# EAGLE design slouchpad_v1_rightpad (EAGLE 8.0.1)

## Sheet 1 of 2
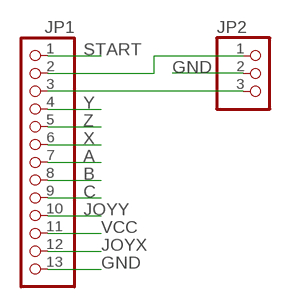
[diagram p0: schematic, sheet 1]

### Parts
JP1  PINHD-1X13  [1X13]
JP2  PINHD-1X3  [1X03]

### Nets
A: JP1.7 ; also sheet 2
B: JP1.8 ; also sheet 2
C: JP1.9 ; also sheet 2
GND: JP1.13 JP2.2 ; also sheet 2
JOYX: JP1.12 ; also sheet 2
JOYY: JP1.10 ; also sheet 2
N$2: JP1.2 JP2.1
N$3: JP1.3 JP2.3
START: JP1.1 ; also sheet 2
VCC: JP1.11 ; also sheet 2
X: JP1.6 ; also sheet 2
Y: JP1.4 ; also sheet 2
Z: JP1.5 ; also sheet 2

## Sheet 2 of 2
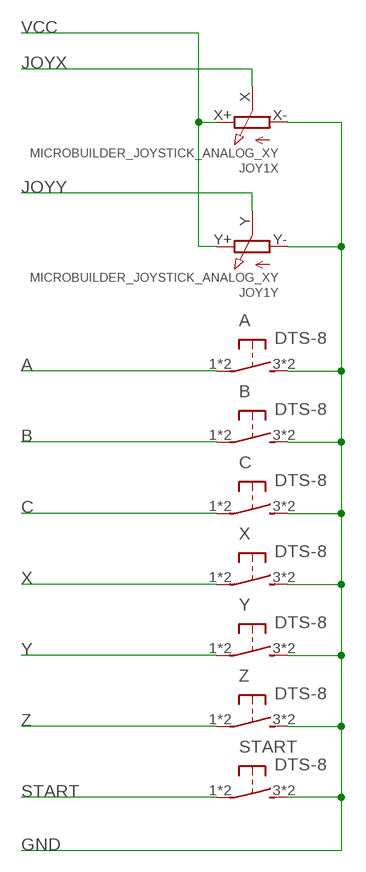
[diagram p1: schematic, sheet 2]

### Parts
A  DTS-8  [DTS-8]
B  DTS-8  [DTS-8]
C  DTS-8  [DTS-8]
JOY1  MICROBUILDER_JOYSTICK_ANALOG_XY  [MICROBUILDER_JOYSTICK_ANALOG_MINITHM]
START  DTS-8  [DTS-8]
X  DTS-8  [DTS-8]
Y  DTS-8  [DTS-8]
Z  DTS-8  [DTS-8]

### Nets
A: A.1 A.2 ; also sheet 1
B: B.1 B.2 ; also sheet 1
C: C.1 C.2 ; also sheet 1
GND: A.3 A.4 B.3 B.4 C.3 C.4 JOY1.X-(X:A) JOY1.Y-(Y:A) START.3 START.4 X.3 X.4 Y.3 Y.4 Z.3 Z.4 ; also sheet 1
JOYX: JOY1.X(X:S) ; also sheet 1
JOYY: JOY1.Y(Y:S) ; also sheet 1
START: START.1 START.2 ; also sheet 1
VCC: JOY1.X+(X:E) JOY1.Y+(Y:E) ; also sheet 1
X: X.1 X.2 ; also sheet 1
Y: Y.1 Y.2 ; also sheet 1
Z: Z.1 Z.2 ; also sheet 1

## Library data of the parts
A B C START X Y Z = switch-tact:DTS-8
JOY1 = adafruit-minianalogthumb:MICROBUILDER_JOYSTICK_ANALOG_XY
JP1 = pinhead:PINHD-1X13: PIN HEADER
JP2 = pinhead:PINHD-1X3: PIN HEADER

## Board
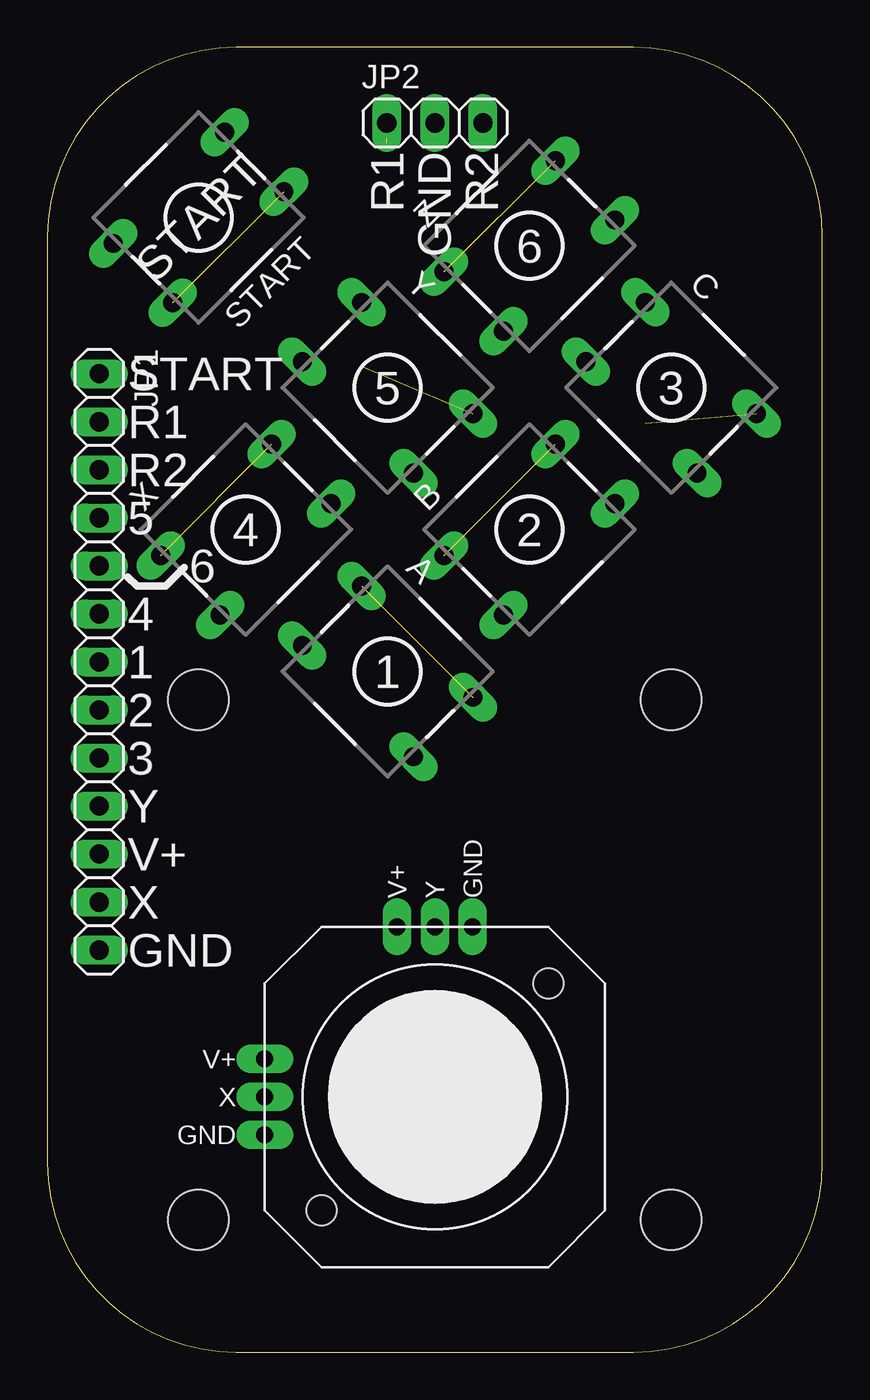
[diagram p2: board, top side]
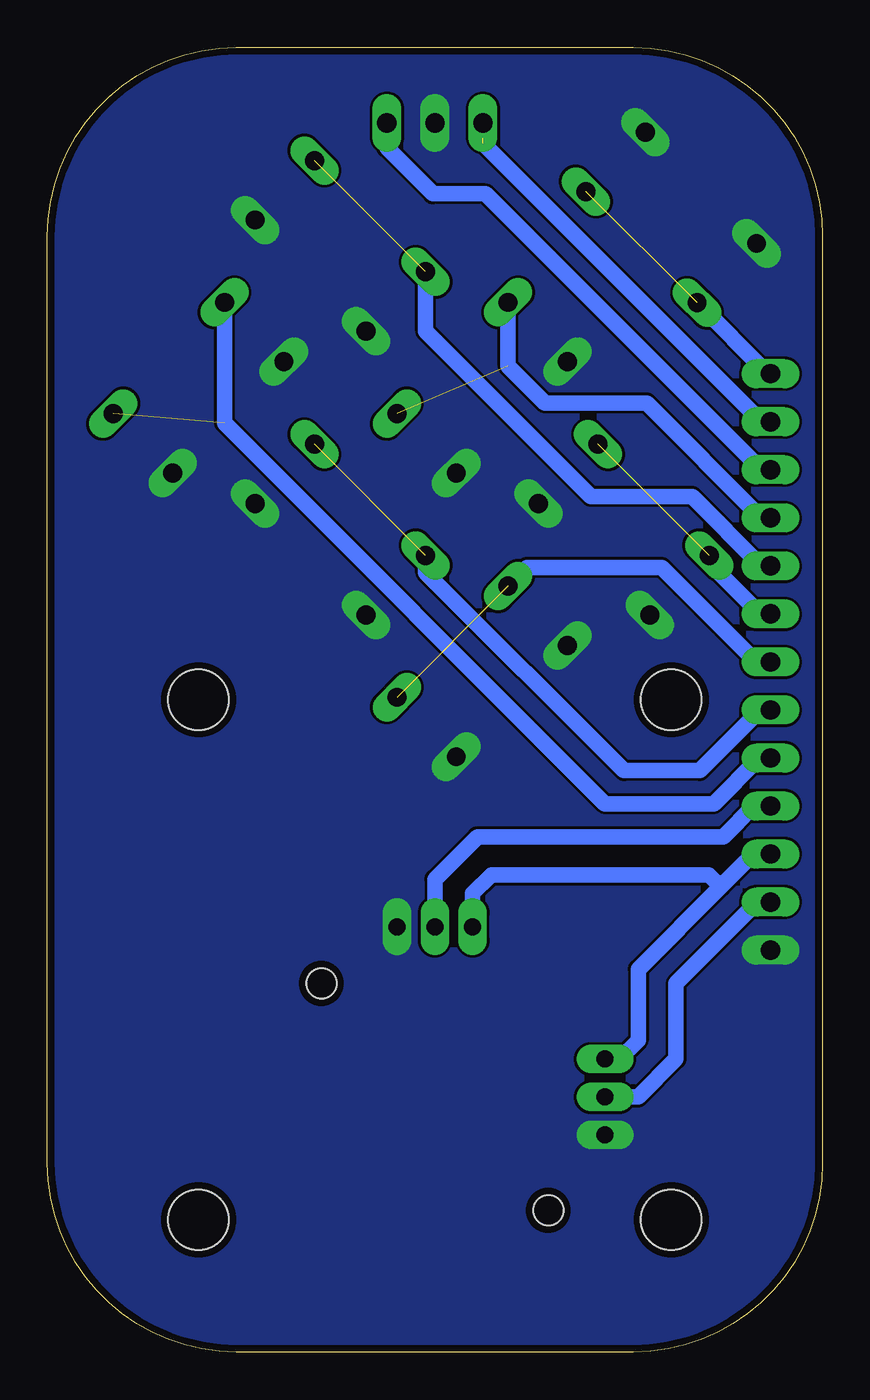
[diagram p3: board, bottom side, seen from below]

Size 41 x 69 mm. Coordinates in mm from the lower left corner, seen from the top.
Outline: 31,69 10,69 arc90 0,59 0,10 arc90 10,0 31,0 arc90 41,10 41,59 arc90 31,69
Copper layers (1*16): Top 0.0356mm / dielectric 1.5011mm / Bottom 0.0356mm
Design rules "oshpark-2layer": minimum track width 6mil, minimum drill 13mil, track to track 6mil, track to pad 6mil, pad to pad 6mil, via to via 6mil, smd to smd 6mil, copper to edge 15mil, drill to drill 6mil, minimum pad ring 7mil, minimum via ring 7mil, stop-mask expansion 2.5mil, vias tented up to drill 0mil, thermal gap 10mil
Holes 3.2 mm at 8,7 33,7 33,34.5 8,34.5

### Footprints (pad centres in the part's own frame; a part is rotated, then mirrored left to right if it is on the bottom)
DTS-8 = drill 1 long: 1 -4.159,2.223; 2 4.159,2.223; 3 -4.159,-2.223; 4 4.159,-2.223
MICROBUILDER_JOYSTICK_ANALOG_MINITHM = drill 0.9 pad 1.5 long: X 0,9; X+ 2,9; X- -2,9; Y 9,0; Y+ 9,2; Y- 9,-2 | hole 1.6: -6,6; 6,-6
1X13 = drill 1.016 long: 1 -15.24,0; 2 -12.7,0; 3 -10.16,0; 4 -7.62,0; 5 -5.08,0; 6 -2.54,0; 7 0,0; 8 2.54,0; 9 5.08,0; 10 7.62,0; 11 10.16,0; 12 12.7,0; 13 15.24,0
1X03 = drill 1.016 long: 1 -2.54,0; 2 0,0; 3 2.54,0

### Placement (x,y rotation side)
A  18,36 315 top
B  25.5,43.5 45 top
C  33,51 315 top
JOY1  20.5,13.5 90 top
JP1  2.75,36.5 270 top
JP2  20.5,65 0 top
START  8,60 225 top
X  10.5,43.5 45 top
Y  18,51 315 top
Z  25.5,58.5 45 top

### Tracks (layer width: path | path; a pad name or v marks a point on that pad's centre or on a via)
A  (1 unrouted)
  Bottom 0.813: JP1.7 3.5,36.5 8.5,41.5 15.64,41.5 A.1
B  (1 unrouted)
  Bottom 0.813: B.1 20.99,41.24 10.5,30.75 6.5,30.75 3.29,33.96 JP1.8
C  (1 unrouted)
  Bottom 0.813: C.1 31.63,49.13 11.5,29 5.75,29 3.33,31.42 JP1.9
GND
  pour Bottom (no thermals): 41,59 41,10 arc-90 31,0 10,0 arc-90 0,10 0,59 arc-90 10,69 31,69 arc-90
JOYX
  Bottom 0.813: JOY1.X 9.75,13.5 7.75,15.5 7.75,19.5 3.45,23.8 JP1.12
JOYY
  Bottom 0.813: JOY1.Y 20.5,25 18.25,27.25 5.25,27.25 3.62,28.88 JP1.10
N$2  (1 unrouted)
  Bottom 0.813: JP2.1 17.96,64.19 | JP1.2 3.23,49.2 17.96,63.93
N$3
  Bottom 0.813: JP2.3 23.04,63.68 20.61,61.25 17.82,61.25 3.23,46.66 JP1.3
START  (1 unrouted)
  Bottom 0.813: JP1.1 2.88,51.74 START.2
VCC
  Bottom 0.813: JOY1.X+ 10.75,15.5 9.75,16.5 9.75,20.25 5.38,24.62 | JP1.11 3.66,26.34 5.38,24.62 | JOY1.Y+ 18.5,24.25 17.5,25.25 6,25.25 5.38,24.62
X  (1 unrouted)
  Bottom 0.813: JP1.6 3.29,39.04 5.99,41.74 X.1
Y  (1 unrouted)
  Bottom 0.813: Y.1 16.63,52.13 14.69,50.19 9.29,50.19 3.23,44.12 JP1.4
Z  (1 unrouted)
  Bottom 0.813: Z.1 20.99,53.99 12.25,45.25 6.9,45.25 3.23,41.58 JP1.5

### Text on the board
tSilk: R1 | GND | R2 | START | 6 | START | 5 | 3 | R1 | R2 | 5 | 4 | 2 | 6 | 4 | 1 | 1 | 2 | 3 | Y | V+ | X | V+ | Y | GND | GND | V+ | X | GND